# Altium schematic sheet Main.SchDoc
size A3; SheetNumber: 1; SheetTotal: 1
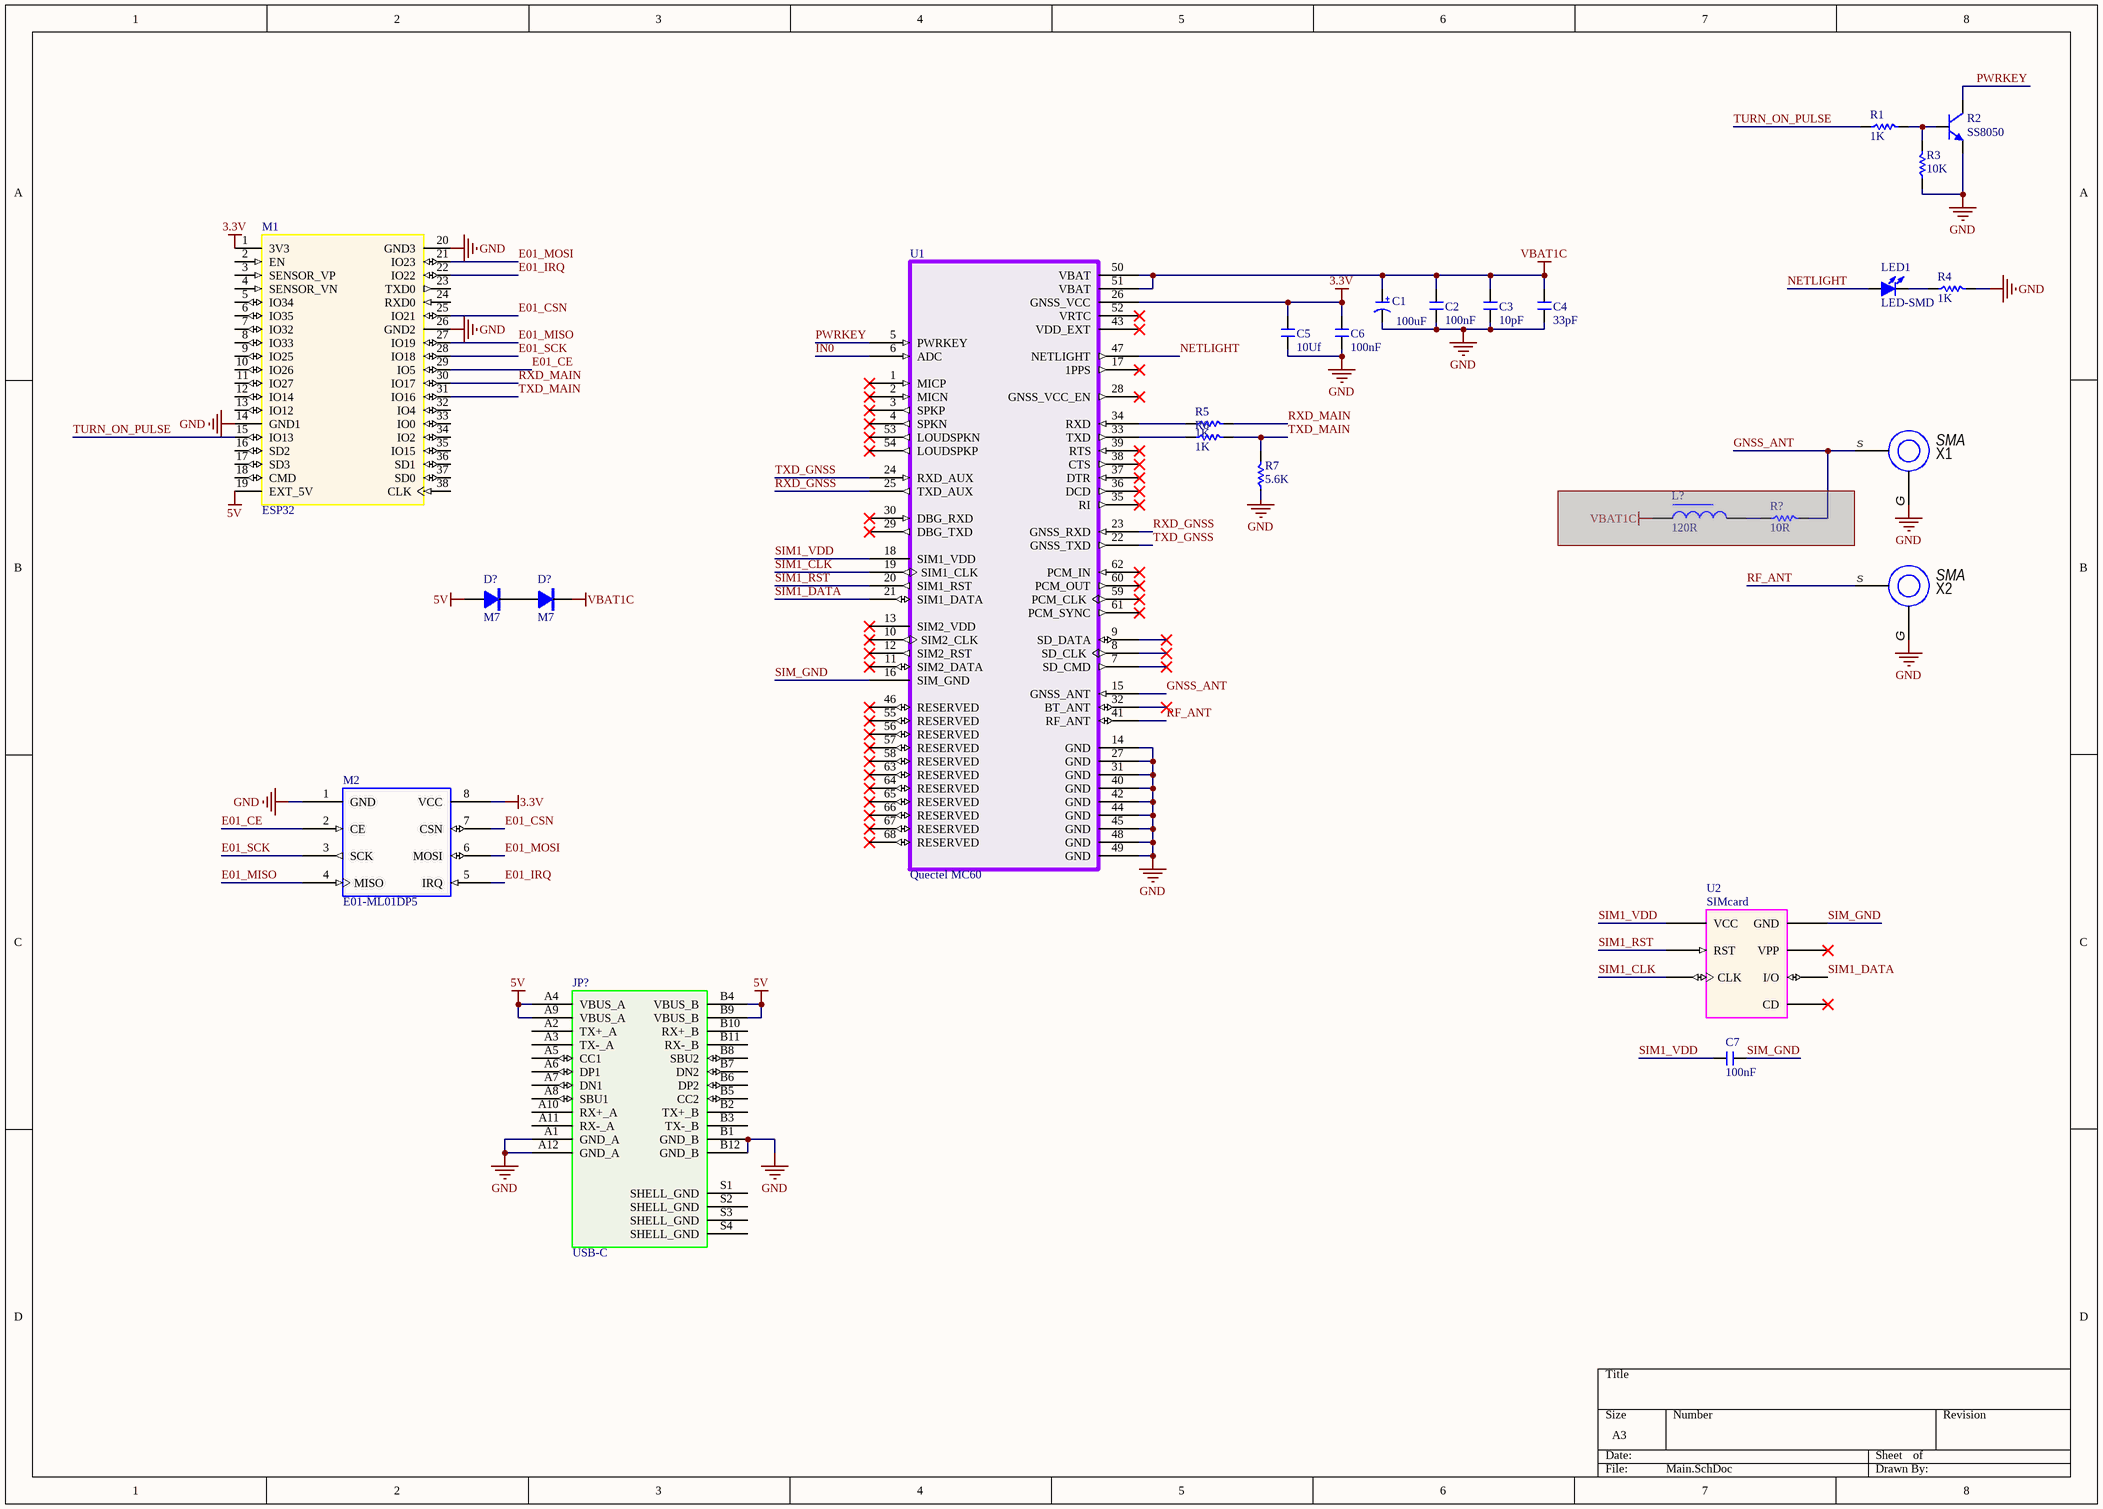
[diagram p0: Main.SchDoc]

## Parts
(Parts that share a designator on the sheet are numbered #1, #2 ... from top to bottom, then left to right.)
C1  100uF  [CD C(6032)]
C2  100nF  [C 0603]
C3  10pF  [C 0603]
C4  33pF  [C 0603]
C5  10Uf  [C 0603]
C6  100nF  [C 0603]
C7  100nF  [C 0603]
D?#1  M7  [SMA]
D?#2  M7  [SMA]
JP?  USB-C  [USB-C-RIGHT]
L?  120R  [L 0805]  (masked out: inside a compile mask, not in the netlist)
LED1  LED-SMD  [LED 0603Y]
M1  ESP32  [NodeMCU(ESP32)]
M2  E01-ML01DP5  [E01-ML01DP5]
R1  1K  [R 0603]
R2  SS8050  [SOT23-3N]
R3  10K  [R 0603]
R4  1K  [R 0603]
R5  1K  [R 0603]
R6  1K  [R 0603]
R7  5.6K  [R 0603]
R?  10R  [R 0805]  (masked out: inside a compile mask, not in the netlist)
U1  Quectel MC60  [Quectel MC60]
U2  SIMcard  [SIMcard_6pin_1]
X1  SMA  [SMA Female-RA]
X2  SMA  [SMA Female-RA]

## Nets
3.3V: C5.1 C6.1 M1.1(3V3) M2.8(VCC) U1.26(GNSS_VCC)
5V: D?#1.1(A) JP?.A4(VBUS_A) JP?.A9(VBUS_A) JP?.B4(VBUS_B) JP?.B9(VBUS_B) M1.19(EXT_5V)
GND: C1.2(K) C2.2 C3.2 C4.2 C5.2 C6.2 JP?.A1(GND_A) JP?.A12(GND_A) JP?.B1(GND_B) JP?.B12(GND_B) M1.14(GND1) M1.20(GND3) M1.26(GND2) M2.1(GND) R2.2(E) R3.1 R4.2 R7.1 U1.14(GND) U1.27(GND) U1.31(GND) U1.40(GND) U1.42(GND) U1.44(GND) U1.45(GND) U1.48(GND) U1.49(GND) X1.G(GND) X2.G(GND)
VBAT1C: C1.1(A) C2.1 C3.1 C4.1 D?#2.2(K) U1.50(VBAT) U1.51(VBAT)
E01_CE: M1.29(IO5) M2.2(CE)
E01_CSN: M1.25(IO21) M2.7(CSN)
E01_IRQ: M1.22(IO22) M2.5(IRQ)
E01_MISO: M1.27(IO19) M2.4(MISO)
E01_MOSI: M1.21(IO23) M2.6(MOSI)
E01_SCK: M1.28(IO18) M2.3(SCK)
GNSS_ANT: U1.15(GNSS_ANT) X1.S(Signal)
IN0: U1.6(ADC)
NETLIGHT: LED1.1(A) U1.47(NETLIGHT)
PWRKEY: R2.3(C) U1.5(PWRKEY)
RF_ANT: U1.41(RF_ANT) X2.S(Signal)
RXD_GNSS: U1.23(GNSS_RXD) U1.25(TXD_AUX)
RXD_MAIN: M1.30(IO17) R5.2
SIM1_CLK: U1.19(SIM1_CLK) U2.C3(CLK)
SIM1_DATA: U1.21(SIM1_DATA) U2.C7(I/O)
SIM1_RST: U1.20(SIM1_RST) U2.C2(RST)
SIM1_VDD: C7.1 U1.18(SIM1_VDD) U2.C1(VCC)
SIM_GND: C7.2 U1.16(SIM_GND) U2.C5(GND)
TURN_ON_PULSE: M1.15(IO13) R1.1
TXD_GNSS: U1.22(GNSS_TXD) U1.24(RXD_AUX)
TXD_MAIN: M1.31(IO16) R6.2 R7.2
NetD?#1_2: D?#1.2(K) D?#2.1(A)
NetLED1_2: LED1.2(K) R4.1
NetR1_2: R1.2 R2.1(B) R3.2
NetR5_1: R5.1 U1.34(RXD)
NetR6_1: R6.1 U1.33(TXD)

Not connected (* = marked no-connect by the designer): JP? A2(TX+_A) A3(TX-_A) A5(CC1) A6(DP1) A7(DN1) A8(SBU1) A10(RX+_A) A11(RX-_A) B2(TX+_B) B3(TX-_B) B5(CC2) B6(DP2) B7(DN2) B8(SBU2) B10(RX+_B) B11(RX-_B) S1(SHELL_GND) S2(SHELL_GND) S3(SHELL_GND) S4(SHELL_GND); M1 2(EN) 3(SENSOR_VP) 4(SENSOR_VN) 5(IO34) 6(IO35) 7(IO32) 8(IO33) 9(IO25) 10(IO26) 11(IO27) 12(IO14) 13(IO12) 16(SD2) 17(SD3) 18(CMD) 23(TXD0) 24(RXD0) 32(IO4) 33(IO0) 34(IO2) 35(IO15) 36(SD1) 37(SD0) 38(CLK); U1 1(MICP)* 2(MICN)* 3(SPKP)* 4(SPKN)* 7(SD_CMD)* 8(SD_CLK)* 9(SD_DATA)* 10(SIM2_CLK)* 11(SIM2_DATA)* 12(SIM2_RST)* 13(SIM2_VDD)* 17(1PPS)* 28(GNSS_VCC_EN)* 29(DBG_TXD)* 30(DBG_RXD)* 32(BT_ANT)* 35(RI)* 36(DCD)* 37(DTR)* 38(CTS)* 39(RTS)* 43(VDD_EXT)* 46(RESERVED)* 52(VRTC)* 53(LOUDSPKN)* 54(LOUDSPKP)* 55(RESERVED)* 56(RESERVED)* 57(RESERVED)* 58(RESERVED)* 59(PCM_CLK)* 60(PCM_OUT)* 61(PCM_SYNC)* 62(PCM_IN)* 63(RESERVED)* 64(RESERVED)* 65(RESERVED)* 66(RESERVED)* 67(RESERVED)* 68(RESERVED)*; U2 C6(VPP)* CD*

## Notes on the sheet
- (in symbol C-CD) +

## Library data of the parts
C1 = C-CD: Solid Tantalum Chip Capacitor, Standard T491 Series - Industrial Grade; Published: 17-Jul-2002; LatestRevisionDate: 19-Mar-2004; LatestRevisionNote: Silkscreen dimensions re-sized.; DatasheetDocument: Mar-2001; PackageDocument: Mar-2001; PackageReference: B; Publisher: Altium Limited; Code_JEITA: 3528-21; ComponentLink1Description: Manufacturer Link; ComponentLink1URL: http://www.kemet.com/; ComponentLink2Description: Datasheet; ComponentLink2URL: http://www.kemet.com/kemet/web/homepage/kechome.nsf/vapubfilesname/F3102TA.pdf/$file/F3102TA.pdf
C2-C7 = C: Non-polar patch capacitor; BOM名称: 无极性贴片电容; 版权归属: 源创客; 学习资源: www.ooocke.com
D?#1 D?#2 = M7: Rectifier diode; BOM名称: 整流二极管; 版权归属: 源创客; 学习资源: www.ooocke.com
JP? = USB-C-RIGHT
L? = L: Low power chip inductor; BOM名称: 小功率贴片电感; 版权归属: 源创客; 学习资源: www.ooocke.com
LED1 = LED-SMD: Patch LED; BOM名称: 贴片LED; 版权归属: 源创客; 学习资源: www.ooocke.com
M1 = NodeMCU(ESP32-WROOM)
R1 R3-R7 R? = R: Chip resistor; 版权归属: 源创客; BOM名称: Chip resistor; 学习资源: www.ooocke.com
R2 = 8050-SMD: High frequency amplification-NPN; BOM名称: 高频放大-NPN型; 版权归属: 源创客; 属性: 40V 1.5A 1W 100MHZ; 学习资源: www.ooocke.com
U1 = MC60: Ultra-small LCC Quad-band GSM/GPRS/GNSS Module
U2 = SIMcard (6pin)
X1 X2 = SMA: RF; Model: *; Manufacturer: *; HelpURL: *; ComponentKind: *